# Altium schematic sheet 07_Misc_2.SchDoc: Misc 2 (part 1 of 2)
size A3; Organization: Lime Microsystems; Address1: Surrey Tech Centre; Address2: Guildford GU2 7YG; Address3: Surrey; Address4: United Kingdom; Revision: v1.1; SheetNumber: 7; SheetTotal: 12
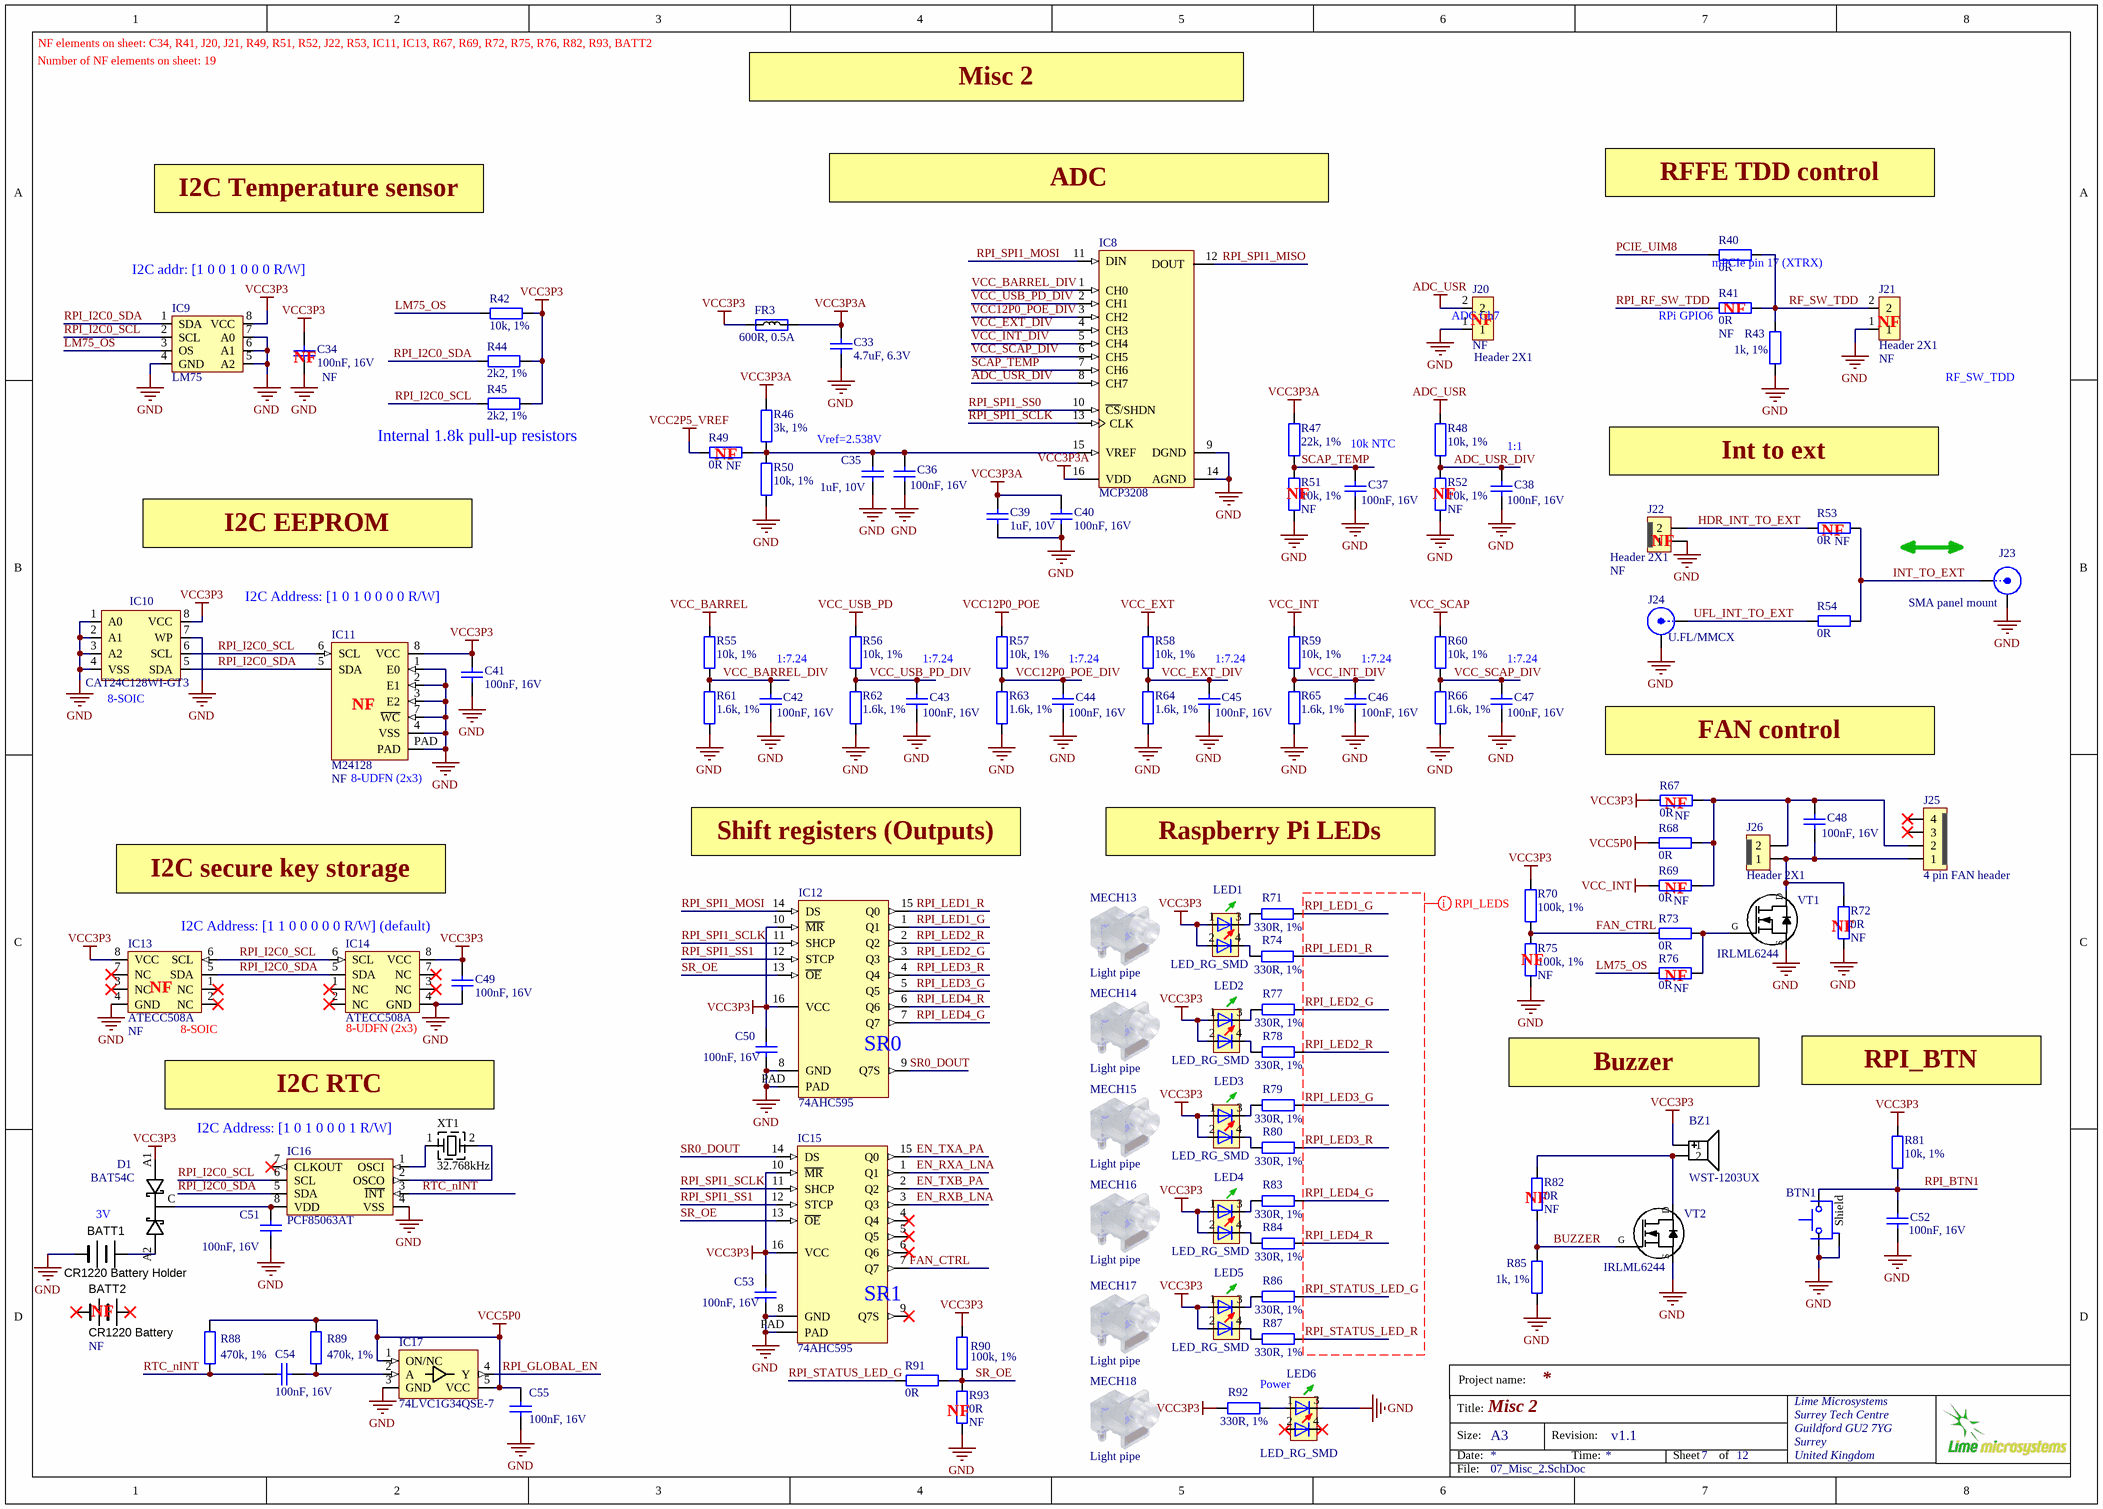
[diagram p0: 07_Misc_2.SchDoc]

## Parts
BATT1  CR1220 Battery Holder  [CR1220_SMD_holder]
BATT2  CR1220 Battery  Assembly Info: NF  (mechanical)
BTN1  Switch tactile right edge  [SW_TACTILE_RIGHT_EDGE]  (value not drawn)
BZ1  WST-1203UX  [BUZZER_WST-1203UX]
C33  4.7uF, 6.3V  [CAP0402]
C34  100nF, 16V  Assembly Info: NF  [CAP0402]
C35  1uF, 10V  [CAP0402]
C36  100nF, 16V  [CAP0402]
C37  100nF, 16V  [CAP0402]
C38  100nF, 16V  [CAP0402]
C39  1uF, 10V  [CAP0402]
C40  100nF, 16V  [CAP0402]
C41  100nF, 16V  [CAP0402]
C42  100nF, 16V  [CAP0402]
C43  100nF, 16V  [CAP0402]
C44  100nF, 16V  [CAP0402]
C45  100nF, 16V  [CAP0402]
C46  100nF, 16V  [CAP0402]
C47  100nF, 16V  [CAP0402]
C48  100nF, 16V  [CAP0402]
C49  100nF, 16V  [CAP0402]
C50  100nF, 16V  [CAP0402]
C51  100nF, 16V  [CAP0402]
C52  100nF, 16V  [CAP0402]
C53  100nF, 16V  [CAP0402]
C54  100nF, 16V  [CAP0402]
C55  100nF, 16V  [CAP0402]
D1  BAT54C  [BAT54C_SOT23-3]
FR3  600R, 0.5A  [RES0402]
IC8  MCP3208  [MCP3208-CI/SL_SOIC16]
IC9  LM75  [HWSON8_LM75]
IC10  CAT24C128WI-GT3  [SOIC127P600-8DL_v2]
IC11  M24128  Assembly Info: NF  [M24128-DFMC6TG]
IC12  74AHC595  [74HC595BQ,115]
IC13  ATECC508A  Assembly Info: NF  [SOIC127P600-8DL_v2]
IC14  ATECC508A  [ATECC508A_UDFN8]
IC15  74AHC595  [74HC595BQ,115]
IC16  PCF85063AT  [PCF85063AT_RTC_SOIC-8]
IC17  74LVC1G34QSE-7  [74AHCT1G126SE-7_BUFFER_SOT353]
J20  Header 2X1  Assembly Info: NF  [HDR_1x2]
J21  Header 2X1  Assembly Info: NF  [HDR_1x2]
J22  Header 2X1  Assembly Info: NF  [Header1x2_TH_LOCKING]
J23  SMA panel mount  [SMA_connector_side]
J24  U.FL/MMCX  [MMCX_UFL_conn_u]
J25  4 pin FAN header  [Header1x4_TH_LOCKING_v2]
J26  Header 2X1  [Header1x2_TH_LOCKING]
LED1  LED_RG_SMD  [LED-2x0603]
LED2  LED_RG_SMD  [LED-2x0603]
LED3  LED_RG_SMD  [LED-2x0603]
LED4  LED_RG_SMD  [LED-2x0603]
LED5  LED_RG_SMD  [LED-2x0603]
LED6  LED_RG_SMD  [LED-2x0603]
MECH13  Light pipe  [LIGHT_PIPE_RIGHT_ANGLE_SLP3-200-100-F]
MECH14  Light pipe  [LIGHT_PIPE_RIGHT_ANGLE_SLP3-200-100-F]
MECH15  Light pipe  [LIGHT_PIPE_RIGHT_ANGLE_SLP3-200-100-F]
MECH16  Light pipe  [LIGHT_PIPE_RIGHT_ANGLE_SLP3-200-100-F]
MECH17  Light pipe  [LIGHT_PIPE_RIGHT_ANGLE_SLP3-200-100-F]
MECH18  Light pipe  [LIGHT_PIPE_RIGHT_ANGLE_SLP3-200-100-F]
R40  0R  [RES0402]
R41  0R  Assembly Info: NF  [RES0402]
R42  10k, 1%  [RES0402]
R43  1k, 1%  [RES0402]
R44  2k2, 1%  [RES0402]
R45  2k2, 1%  [RES0402]
R46  3k, 1%  [RES0402]
R47  22k, 1%  [RES0402]
R48  10k, 1%  [RES0402]
R49  0R  Assembly Info: NF  [RES0402_v2]
R50  10k, 1%  [RES0402]
R51  10k, 1%  Assembly Info: NF  [RES0402]
R52  10k, 1%  Assembly Info: NF  [RES0402]
R53  0R  Assembly Info: NF  [RES0402_v2]
R54  0R  [RES0402_v2]
R55  10k, 1%  [RES0402]
R56  10k, 1%  [RES0402]
R57  10k, 1%  [RES0402]
R58  10k, 1%  [RES0402]
R59  10k, 1%  [RES0402]
R60  10k, 1%  [RES0402]
R61  1.6k, 1%  [RES0402]
R62  1.6k, 1%  [RES0402]
R63  1.6k, 1%  [RES0402]
R64  1.6k, 1%  [RES0402]
R65  1.6k, 1%  [RES0402]
R66  1.6k, 1%  [RES0402]
R67  0R  Assembly Info: NF  [RES0402]
R68  0R  [RES0402]
R69  0R  Assembly Info: NF  [RES0402]
R70  100k, 1%  [RES0402]
R71  330R, 1%  [RES0402]
R72  0R  Assembly Info: NF  [RES0402]
R73  0R  [RES0402]
R74  330R, 1%  [RES0402]
R75  100k, 1%  Assembly Info: NF  [RES0402]
R76  0R  Assembly Info: NF  [RES0402]
R77  330R, 1%  [RES0402]
R78  330R, 1%  [RES0402]
R79  330R, 1%  [RES0402]
R80  330R, 1%  [RES0402]
R81  10k, 1%  [RES0402]
R82  0R  Assembly Info: NF  [RES0402]
R83  330R, 1%  [RES0402]
R84  330R, 1%  [RES0402]
R85  1k, 1%  [RES0402]
R86  330R, 1%  [RES0402]
R87  330R, 1%  [RES0402]
R88  470k, 1%  [RES0402]
R89  470k, 1%  [RES0402]
R90  100k, 1%  [RES0402]
R91  0R  [RES0402]
R92  330R, 1%  [RES0402]
R93  0R  Assembly Info: NF  [RES0402]
VT1  IRLML6244  [SOT23-3]
VT2  IRLML6244  [SOT23-3]
XT1  32.768kHz  [CRYSTAL_2PIN_RTC_RT3215]

## Nets
ADC_USR: J20.2 R48.1
GND: BATT1.NEGATIVE BTN1.2 BTN1.Shield C33.1 C34.2 C35.1 C36.2 C37.2 C38.2 C39.1 C40.1 C41.2 C42.2 C43.2 C44.2 C45.2 C46.2 C47.2 C49.2 C50.1 C51.2 C52.2 C53.1 C55.2 IC8.9(DGND) IC8.14(AGND) IC9.4(GND) IC9.5(A2) IC9.6(A1) IC9.7(A0) IC10.1(A0) IC10.2(A1) IC10.3(A2) IC10.4(VSS) IC10.7(WP) IC11.1(E0) IC11.2(E1) IC11.3(E2) IC11.4(VSS) IC11.7(~{WC}) IC11.PAD IC12.8(GND) IC12.PAD IC13.4(GND) IC14.4(GND) IC15.8(GND) IC15.PAD IC16.4(VSS) IC17.3(GND) J20.1 J21.1 J22.1 J23.2(Y) J24.2(Y) LED6.3 R43.2 R50.2 R51.2 R52.2 R61.1 R62.1 R63.1 R64.1 R65.1 R66.1 R72.1 R75.2 R85.2 R93.2 VT1.S VT2.S
VCC2P5_VREF: R49.1
VCC3P3: BZ1.1 C34.1 C41.1 C49.1 C50.2 C53.2 D1.A1 FR3.1 IC9.8(VCC) IC10.8(VCC) IC11.8(VCC) IC12.10(~{MR}) IC12.16(VCC) IC13.8(VCC) IC14.8(VCC) IC15.10(~{MR}) IC15.16(VCC) LED1.1 LED1.2 LED2.1 LED2.2 LED3.1 LED3.2 LED4.1 LED4.2 LED5.1 LED5.2 R42.2 R44.2 R45.2 R67.1 R70.1 R81.1 R90.1 R92.2
VCC3P3A: C33.2 C39.2 C40.2 FR3.2 IC8.16(VDD) R46.2 R47.1
VCC5P0: C55.1 IC17.1(ON/NC) IC17.5(VCC) R68.1 R88.2 R89.2
VCC12P0_POE: R57.1
VCC_BARREL: R55.1
VCC_EXT: R58.1
VCC_INT: R59.1 R69.1
VCC_SCAP: R60.1
VCC_USB_PD: R56.1
ADC_USR_DIV: C38.1 IC8.8(CH7) R48.2 R52.1
BUZZER: R82.1 R85.1 VT2.G
EN_RXA_LNA: IC15.1(Q1)
EN_RXB_LNA: IC15.3(Q3)
EN_TXA_PA: IC15.15(Q0)
EN_TXB_PA: IC15.2(Q2)
FAN_CTRL: IC15.7(Q7) R70.2 R73.1 R75.1
HDR_INT_TO_EXT: J22.2 R53.2
INT_TO_EXT: J23.1(X) R53.1 R54.1
LM75_OS: IC9.3(OS) R42.1 R76.1
PCIE_UIM8: R40.2
RF_SW_TDD: J21.2 R40.1 R41.1 R43.1
RPI_BTN1: BTN1.1 C52.1 R81.2
RPI_GLOBAL_EN: IC17.4(Y)
RPI_I2C0_SCL: IC9.2(SCL) IC10.6(SCL) IC11.6(SCL) IC13.6(SCL) IC14.6(SCL) IC16.6(SCL) R45.1
RPI_I2C0_SDA: IC9.1(SDA) IC10.5(SDA) IC11.5(SDA) IC13.5(SDA) IC14.5(SDA) IC16.5(SDA) R44.1
RPI_LED1_G: IC12.1(Q1) R71.1
RPI_LED1_R: IC12.15(Q0) R74.1
RPI_LED2_G: IC12.3(Q3) R77.1
RPI_LED2_R: IC12.2(Q2) R78.1
RPI_LED3_G: IC12.5(Q5) R79.1
RPI_LED3_R: IC12.4(Q4) R80.1
RPI_LED4_G: IC12.7(Q7) R83.1
RPI_LED4_R: IC12.6(Q6) R84.1
RPI_RF_SW_TDD: R41.2
RPI_SPI1_MISO: IC8.12(DOUT)
RPI_SPI1_MOSI: IC8.11(DIN) IC12.14(DS)
RPI_SPI1_SCLK: IC8.13(CLK) IC12.11(SHCP) IC15.11(SHCP)
RPI_SPI1_SS0: IC8.10(~{CS}/SHDN)
RPI_SPI1_SS1: IC12.12(STCP) IC15.12(STCP)
RPI_STATUS_LED_G: R86.1 R91.2
RPI_STATUS_LED_R: R87.1
RTC_nINT: C54.1 IC16.3(~{INT}) R88.1
SCAP_TEMP: C37.1 IC8.7(CH6) R47.2 R51.1
SR0_DOUT: IC12.9(Q7S) IC15.14(DS)
SR_OE: IC12.13(~{OE}) IC15.13(~{OE}) R90.2 R91.1 R93.1
UFL_INT_TO_EXT: J24.1(X) R54.2
VCC12P0_POE_DIV: C44.1 IC8.3(CH2) R57.2 R63.2
VCC_BARREL_DIV: C42.1 IC8.1(CH0) R55.2 R61.2
VCC_EXT_DIV: C45.1 IC8.4(CH3) R58.2 R64.2
VCC_INT_DIV: C46.1 IC8.5(CH4) R59.2 R65.2
VCC_SCAP_DIV: C47.1 IC8.6(CH5) R60.2 R66.2
VCC_USB_PD_DIV: C43.1 IC8.2(CH1) R56.2 R62.2
NetBATT1_POSITIVE: BATT1.POSITIVE D1.A2
NetBZ1_2: BZ1.2 R82.2 VT2.D
NetC35_2: C35.2 C36.1 IC8.15(VREF) R46.1 R49.2 R50.1
NetC48_1: C48.1 J25.2 J26.2 R67.2 R68.2 R69.2
NetC48_2: C48.2 J25.1 J26.1 R72.2 VT1.D
NetC51_1: C51.1 D1.C IC16.8(VDD)
NetC54_2: C54.2 IC17.2(A) R89.1
NetIC16_1: IC16.1(OSCI) XT1.1(X)
NetIC16_2: IC16.2(OSCO) XT1.2(X)
NetLED1_3: LED1.3 R71.2
NetLED1_4: LED1.4 R74.2
NetLED2_3: LED2.3 R77.2
NetLED2_4: LED2.4 R78.2
NetLED3_3: LED3.3 R79.2
NetLED3_4: LED3.4 R80.2
NetLED4_3: LED4.3 R83.2
NetLED4_4: LED4.4 R84.2
NetLED5_3: LED5.3 R86.2
NetLED5_4: LED5.4 R87.2
NetLED6_1: LED6.1 R92.1
NetR73_2: R73.2 R76.2 VT1.G

Not connected (* = marked no-connect by the designer): BATT2 NEGATIVE* POSITIVE*; IC13 1(NC)* 2(NC)* 3(NC)* 7(NC)*; IC14 1(NC)* 2(NC)* 3(NC)* 7(NC)*; IC15 4(Q4)* 5(Q5)* 6(Q6)* 9(Q7S)*; IC16 7(CLKOUT)*; J25 3* 4*; LED6 2* 4*

## Layout directives
net class RPI_LEDS: RPI_LED1_G, RPI_LED1_R, RPI_LED2_G, RPI_LED2_R, RPI_LED3_G, RPI_LED3_R, RPI_LED4_G, RPI_LED4_R, RPI_STATUS_LED_G, RPI_STATUS_LED_R

## Notes on the sheet
- NF elements on sheet: C34, R41, J20, J21, R49, R51, R52, J22, R53, IC11, IC13, R67, R69, R72, R75, R76, R82, R93, BATT2
- Number of NF elements on sheet: 19
- Misc 2
- I2C Temperature sensor
- ADC
- RFFE TDD control
- I2C addr: [1 0 0 1 0 0 0 R/W]
- (near R40) mPCIe pin 17 (XTRX)
- (near R41) NF
- (near C34) NF
- (near J20) ADC Ch7
- (near J20) NF
- RPi GPIO6
- (near J21) NF
- (near J21) RF_SW_TDD
- (near R45) Internal 1.8k pull-up resistors
- Vref=2.538V
- 10k NTC
- (near C38) 1:1
- (near R49) NF
- (near R51) NF
- (near R52) NF
- Int to ext
- I2C EEPROM
- (near J22) NF
- (near R53) NF
- I2C Address: [1 0 1 0 0 0 0 R/W]
- (near IC10) 8-SOIC
- (near IC11) NF
- 1:7.24
- (near C47) 1:7.24
- (near IC11) 8-UDFN (2x3)
- FAN control
- Shift registers (Outputs)
- Raspberry Pi LEDs
- (near R67) NF
- I2C secure key storage
- (near R69) NF
- (near IC13) NF
- I2C Address: [1 1 0 0 0 0 0 R/W] (default)
- (near R75) NF
- (near R76) NF
- (near R72) NF
- (near IC13) 8-SOIC
- (near IC14) 8-UDFN (2x3)
- (near IC12) SR0
- I2C RTC
- Buzzer
- (near R81) RPI_BTN
- (near XT1) I2C Address: [1 0 1 0 0 0 1 R/W]
- 3V
- (near R82) NF
- (near BATT2) NF
- (near IC15) SR1
- Power
- (near R93) NF
- Project name:
- Title:
- Size:
- Date:
- A3
- Revision:
- Time:
- Sheet
- of
- File: